# Altium project DAQ.PrjPcb
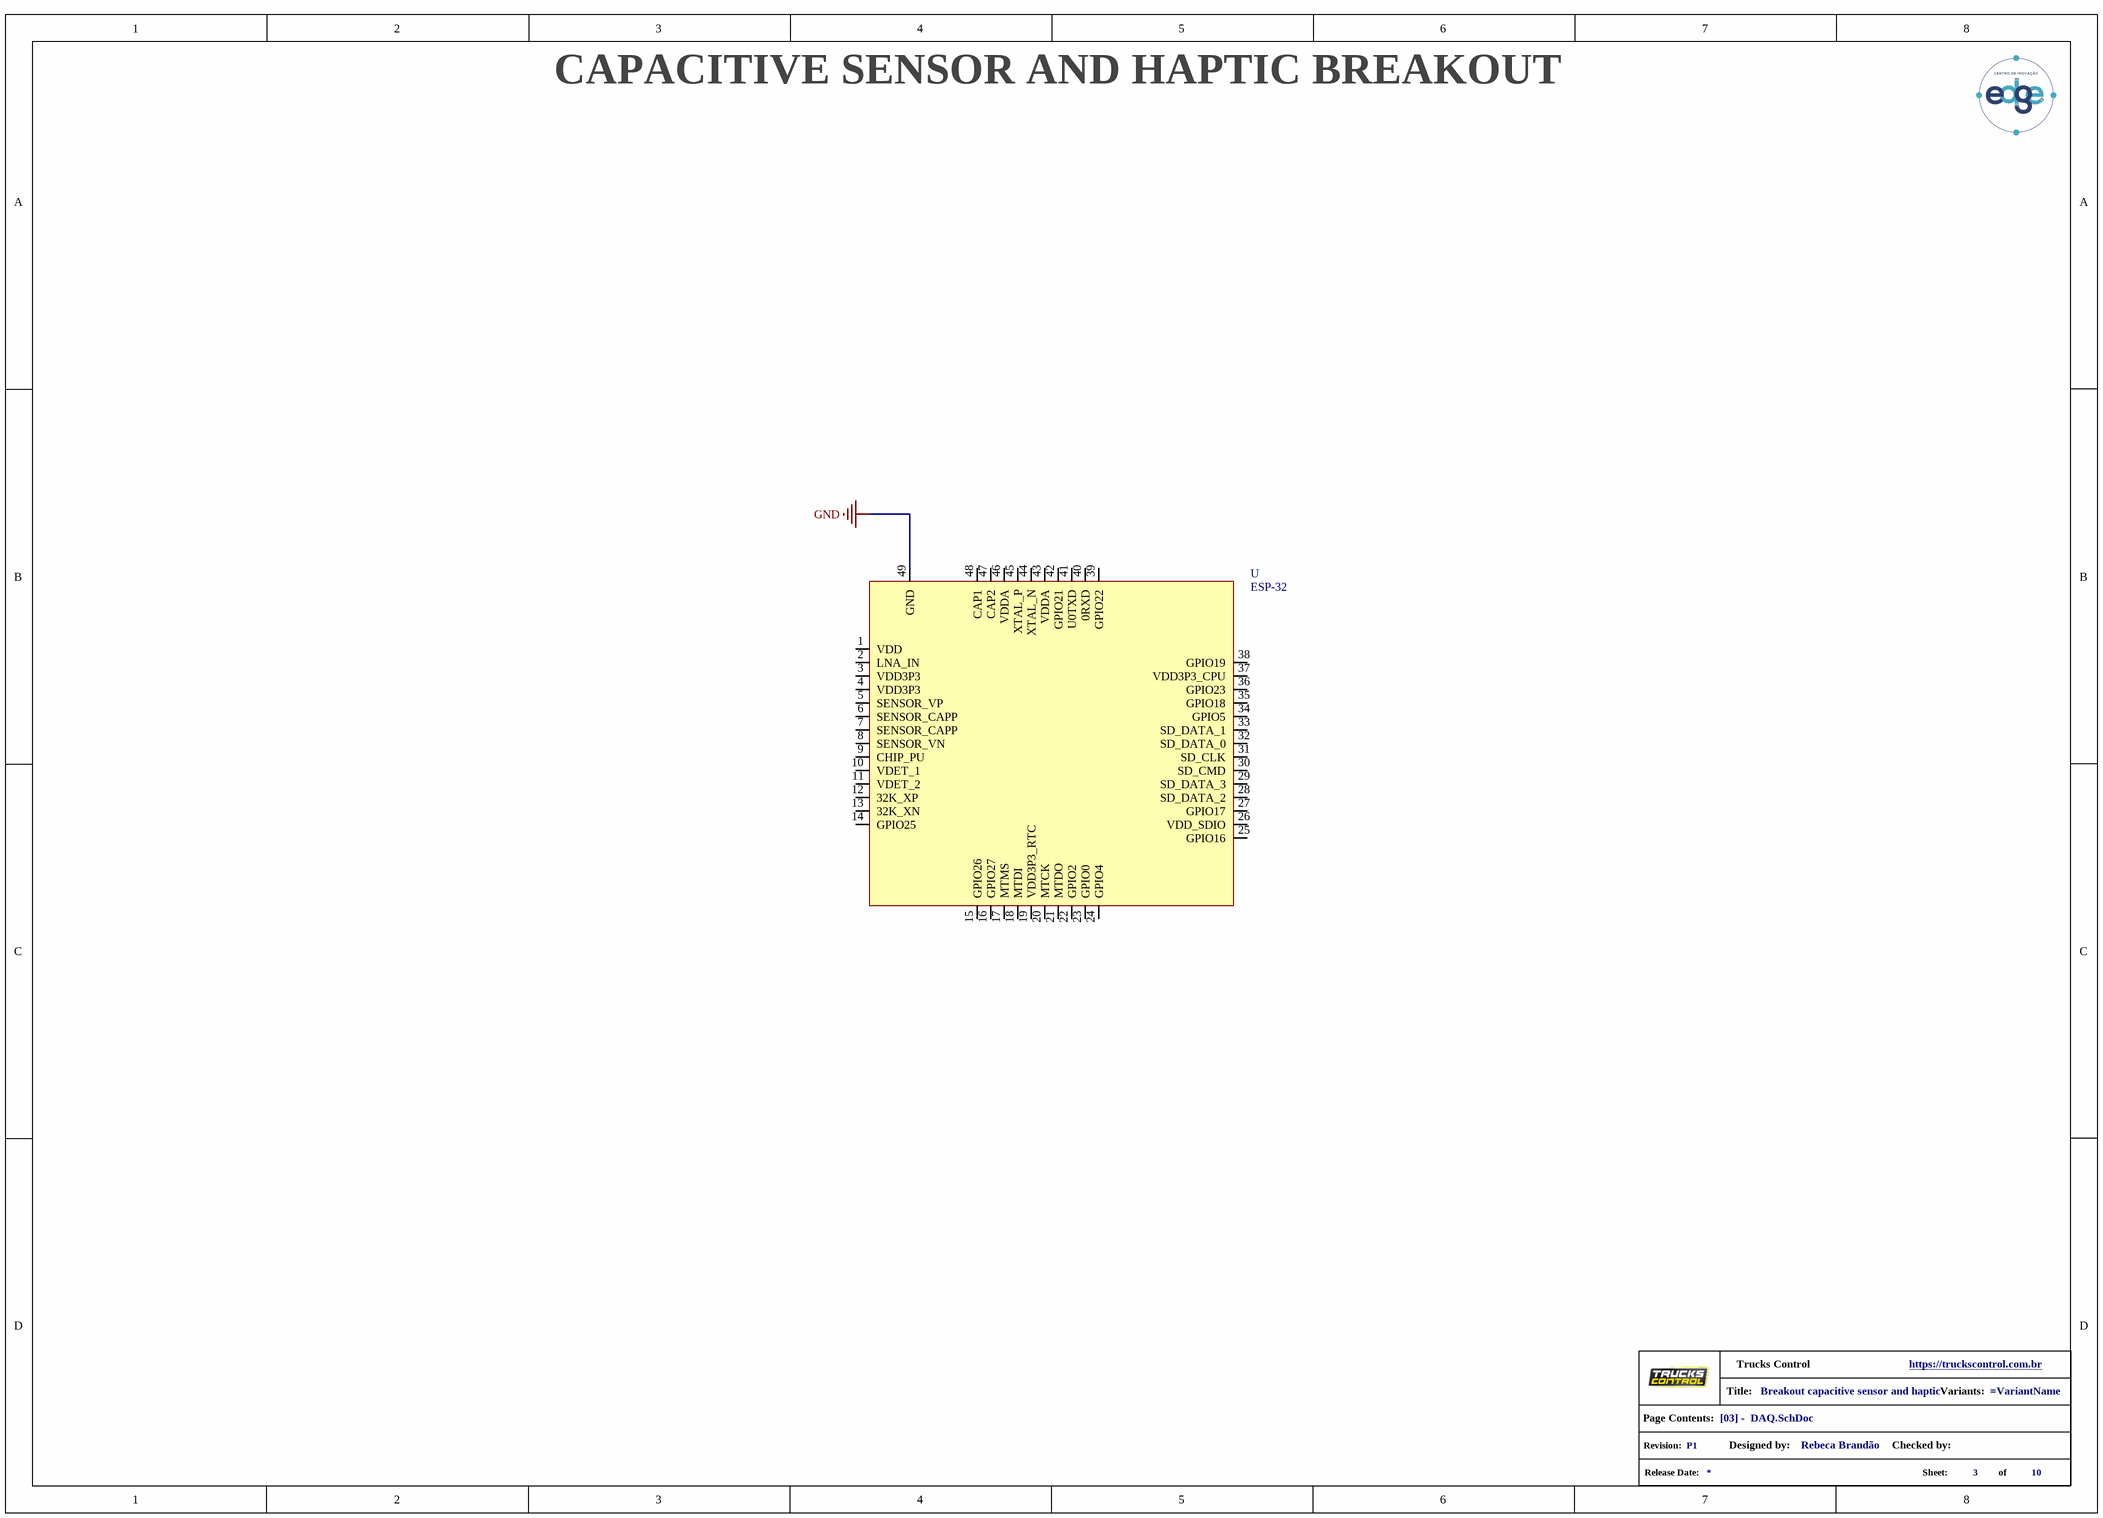
[diagram p0: [03] -  DAQ.SchDoc]
Company: Trucks Control; DesignedProject: Rebeca Brandão; NotFitted: NF; TItleProject: Breakout capacitive sensor and haptic; VersionRevision: P1; Website: https://truckscontrol.com.br
5 sheets, 6 parts. Net scope: global (net labels, ports and power ports of the same name join across sheets).
Board file: DAQ.PcbDoc
Sheets:
  [03] -  DAQ.SchDoc
  DAQ.SchDoc
    Designator = [01] - COVER PAGE.SchDoc
    Designator = [02] - BLOCK DIAGRAM.SchDoc
    Designator = [04] - REVISION HISTORY.SchDoc

## Sheet [03] -  DAQ.SchDoc
size A3; DocumentNumber: 3; SheetNumber: 3; SheetTotal: 10

### Parts
GPH?  info_project  (value not drawn)  (graphical)
U  ESP-32  (no BOM)

### Nets
GND: U.49(GND)

Not connected (* = marked no-connect by the designer): U 1(VDD) 2(LNA_IN) 3(VDD3P3) 4(VDD3P3) 5(SENSOR_VP) 6(SENSOR_CAPP) 7(SENSOR_CAPP) 8(SENSOR_VN) 9(CHIP_PU) 10(VDET_1) 11(VDET_2) 12(32K_XP) 13(32K_XN) 14(GPIO25) 15(GPIO26) 16(GPIO27) 17(MTMS) 18(MTDI) 19(VDD3P3_RTC) 20(MTCK) 21(MTDO) 22(GPIO2) 23(GPIO0) 24(GPIO4) 25(GPIO16) 26(VDD_SDIO) 27(GPIO17) 28(SD_DATA_2) 29(SD_DATA_3) 30(SD_CMD) 31(SD_CLK) 32(SD_DATA_0) 33(SD_DATA_1) 34(GPIO5) 35(____GPIO18) 36(GPIO23) 37(VDD3P3_CPU) 38(GPIO19) 39(GPIO22) 40(0RXD) 41(U0TXD) 42(GPIO21) 43(VDDA) 44(XTAL_N) 45(XTAL_P) 46(VDDA) 47(CAP2) 48(CAP1)

### Notes on the sheet
- CAPACITIVE SENSOR AND HAPTIC BREAKOUT
- (in symbol info_project) Title:; Variants:; Page Contents:; Revision:; Designed by:; Checked by:; Release Date:; Sheet:; of

### Library data of the parts
GPH? = info_project: GRAPHICAL - Info Project
U = ESP32: Supplier 1: Digi-Key; Supplier Part Number 1: 1904-1004-1-ND; .SchChecked: *

## Sheet DAQ.SchDoc
size A4; DocumentNumber: 10; SheetNumber: 10; SheetTotal: 10
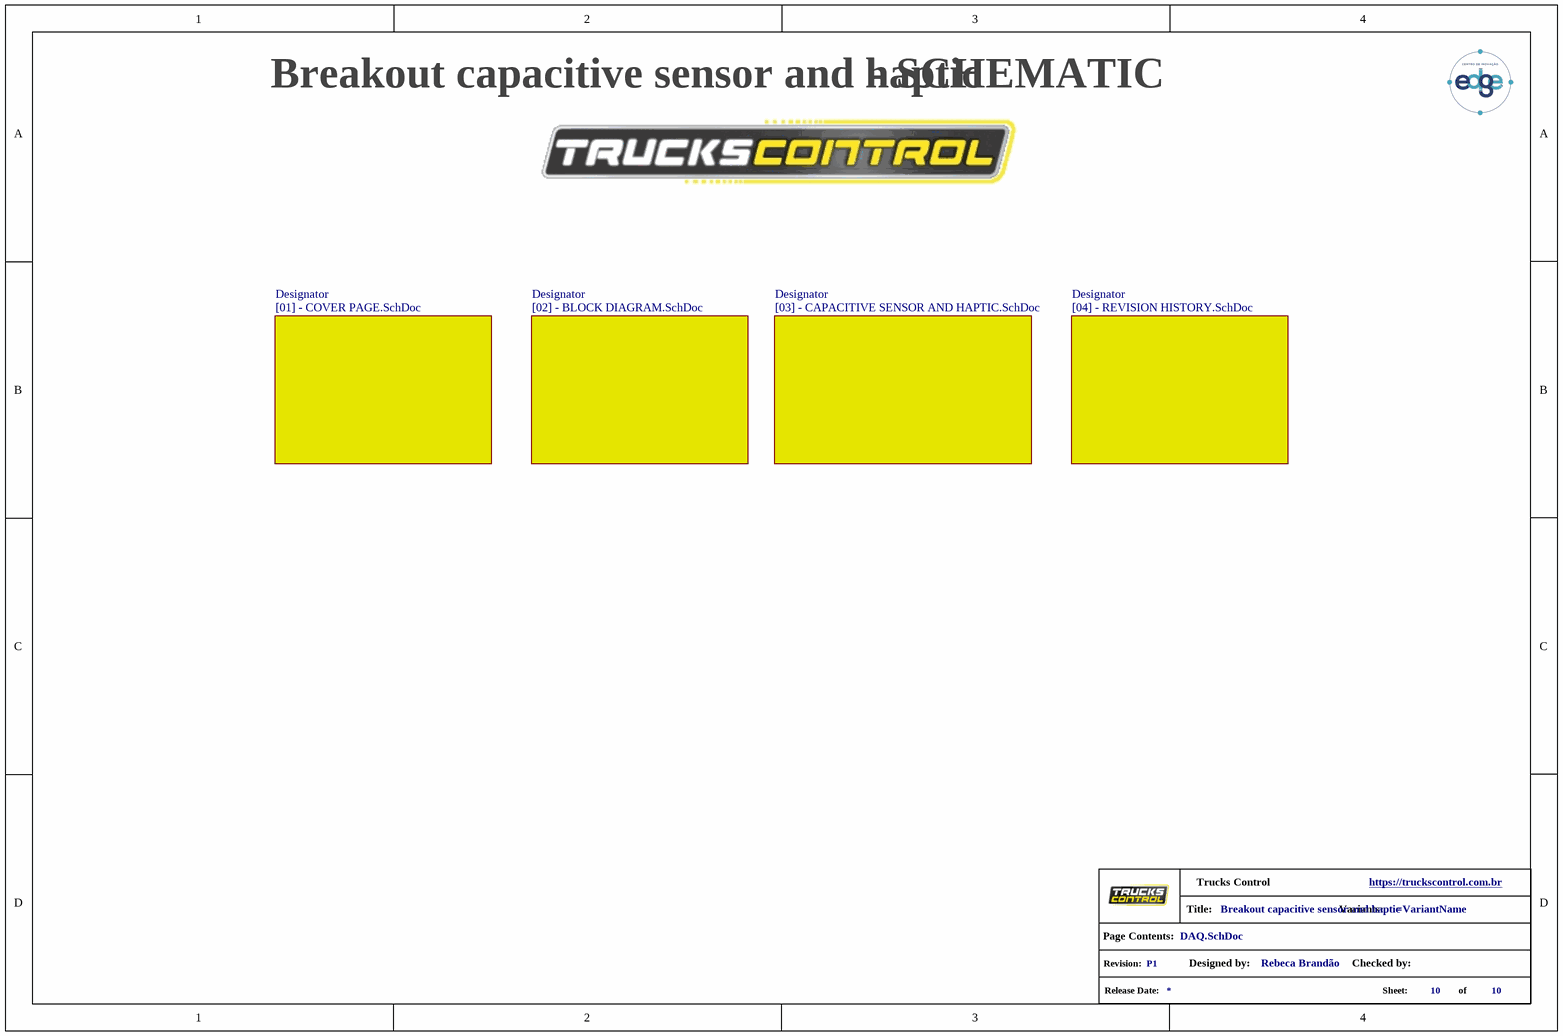
[diagram p1: DAQ.SchDoc]

### Parts
(Parts that share a designator on the sheet are numbered #1, #2 ... from top to bottom, then left to right.)
*?#1  info_project  (value not drawn)  (graphical)

### Sub-sheets
Designator = [01] - COVER PAGE.SchDoc: no entries
Designator = [02] - BLOCK DIAGRAM.SchDoc: no entries
Designator = [03] - CAPACITIVE SENSOR AND HAPTIC.SchDoc (file not in this document): no entries
Designator = [04] - REVISION HISTORY.SchDoc: no entries

### Notes on the sheet
- - SCHEMATIC
- (in symbol info_project) Title:; Variants:; Page Contents:; Revision:; Designed by:; Checked by:; Release Date:; Sheet:; of

### Library data of the parts
*?#1 = info_project: GRAPHICAL - Info Project

## Sheet [01] - COVER PAGE.SchDoc
size A3; DocumentNumber: 1; SheetNumber: 1; SheetTotal: 10
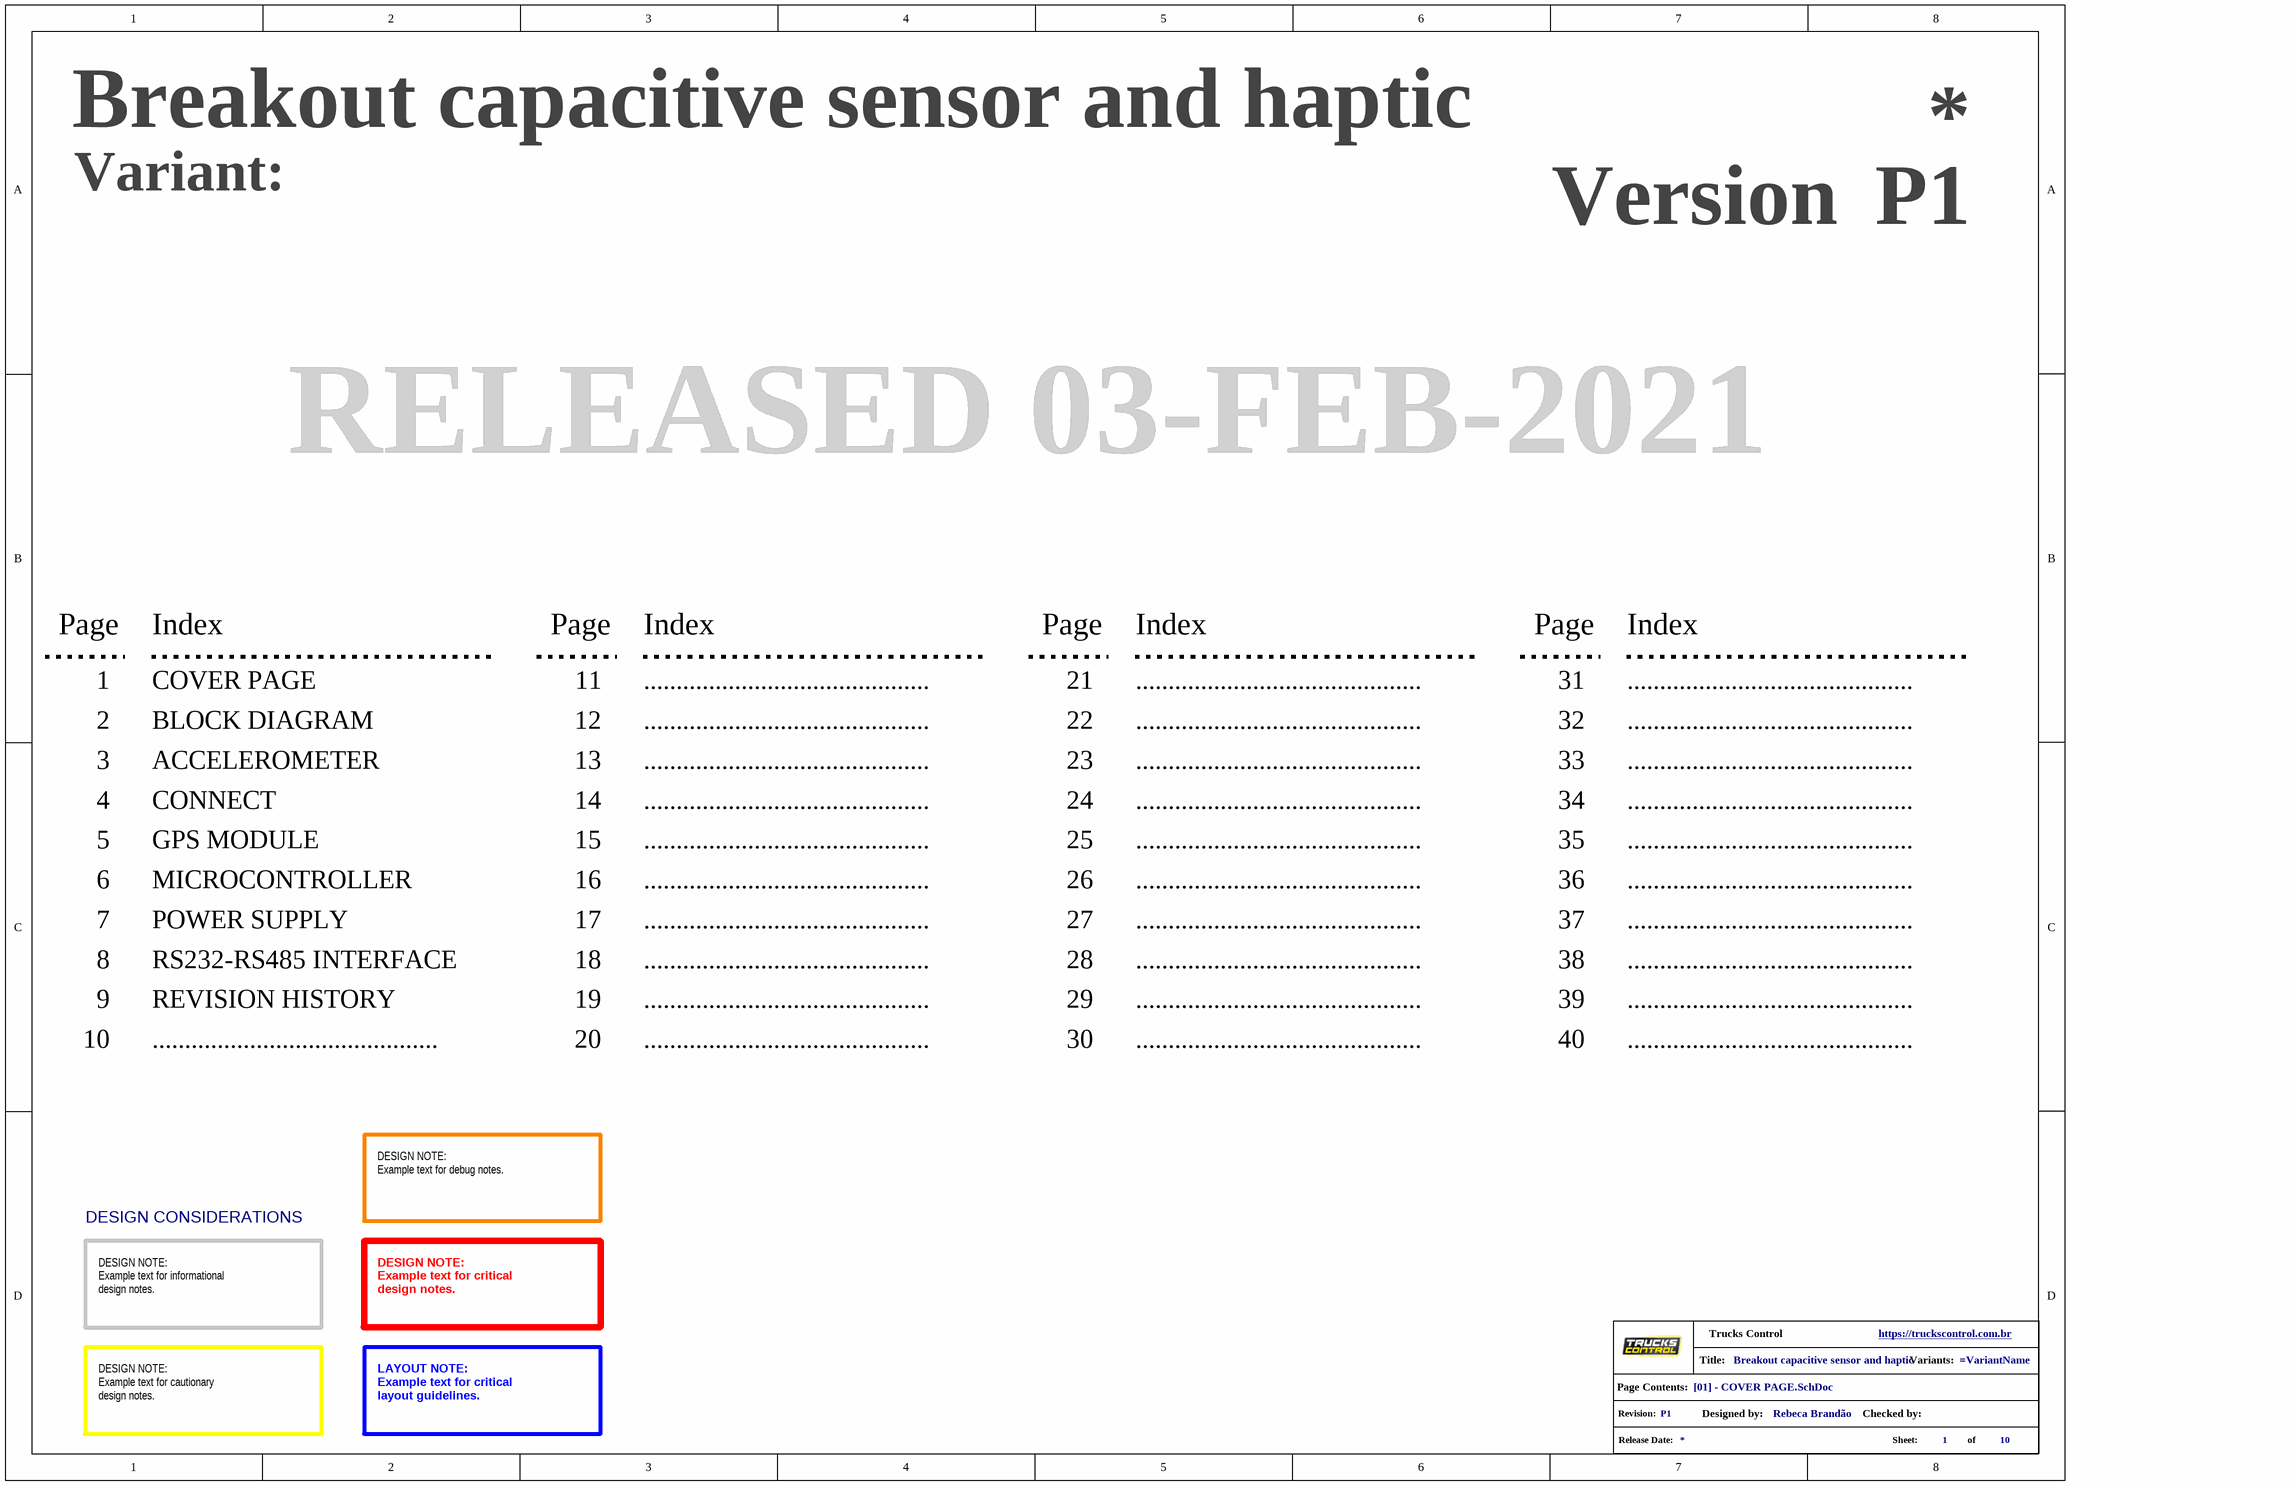
[diagram p2: [01] - COVER PAGE.SchDoc]

### Parts
(Parts that share a designator on the sheet are numbered #1, #2 ... from top to bottom, then left to right.)
*?#2  info_project  (value not drawn)  (graphical)

### Notes on the sheet
- Variant:
- Version
- RELEASED 03-FEB-2021
- Page
- Index
- 1
- COVER PAGE
- 11
- ............................................
- 21
- 31
- 2
- 3
- BLOCK DIAGRAM
- ACCELEROMETER
- 12
- 13
- 22
- 23
- 32
- 33
- 4
- CONNECT
- 14
- 24
- 34
- 5
- 6
- GPS MODULE
- MICROCONTROLLER
- 15
- 16
- 25
- 26
- 35
- 36
- 7
- 8
- POWER SUPPLY
- RS232-RS485 INTERFACE
- 17
- 18
- 27
- 28
- 37
- 38
- 9
- REVISION HISTORY
- 19
- 29
- 39
- 10
- 20
- 30
- 40
- DESIGN CONSIDERATIONS
- DESIGN NOTE:
  Example text for debug notes.
- DESIGN NOTE:
  Example text for informational
  design notes.
- DESIGN NOTE:
  Example text for critical
  design notes.
- DESIGN NOTE:
  Example text for cautionary
  design notes.
- LAYOUT NOTE:
  Example text for critical
  layout guidelines.
- (in symbol info_project) Title:; Variants:; Page Contents:; Revision:; Designed by:; Checked by:; Release Date:; Sheet:; of

### Library data of the parts
*?#2 = info_project: GRAPHICAL - Info Project

## Sheet [02] - BLOCK DIAGRAM.SchDoc
size A2; DocumentNumber: 2; SheetNumber: 2; SheetTotal: 10; PageSetup: Record=PageOptions|CenterHorizontal=True|CenterVertical=True|PrintScale=0.52|XCorrection=1.00|YCorrection=1.00|PrintKind=1|BorderSize=5000000|LeftOffset=0|BottomOffset=0|Orientation=2|PaperLength=1000|PaperWidth=1000|Scale=100|PaperSource=4|PrintQuality=600|MediaType=1|DitherType=10|PrintScaleMode=1|PaperKind=A4|PaperIndex=9
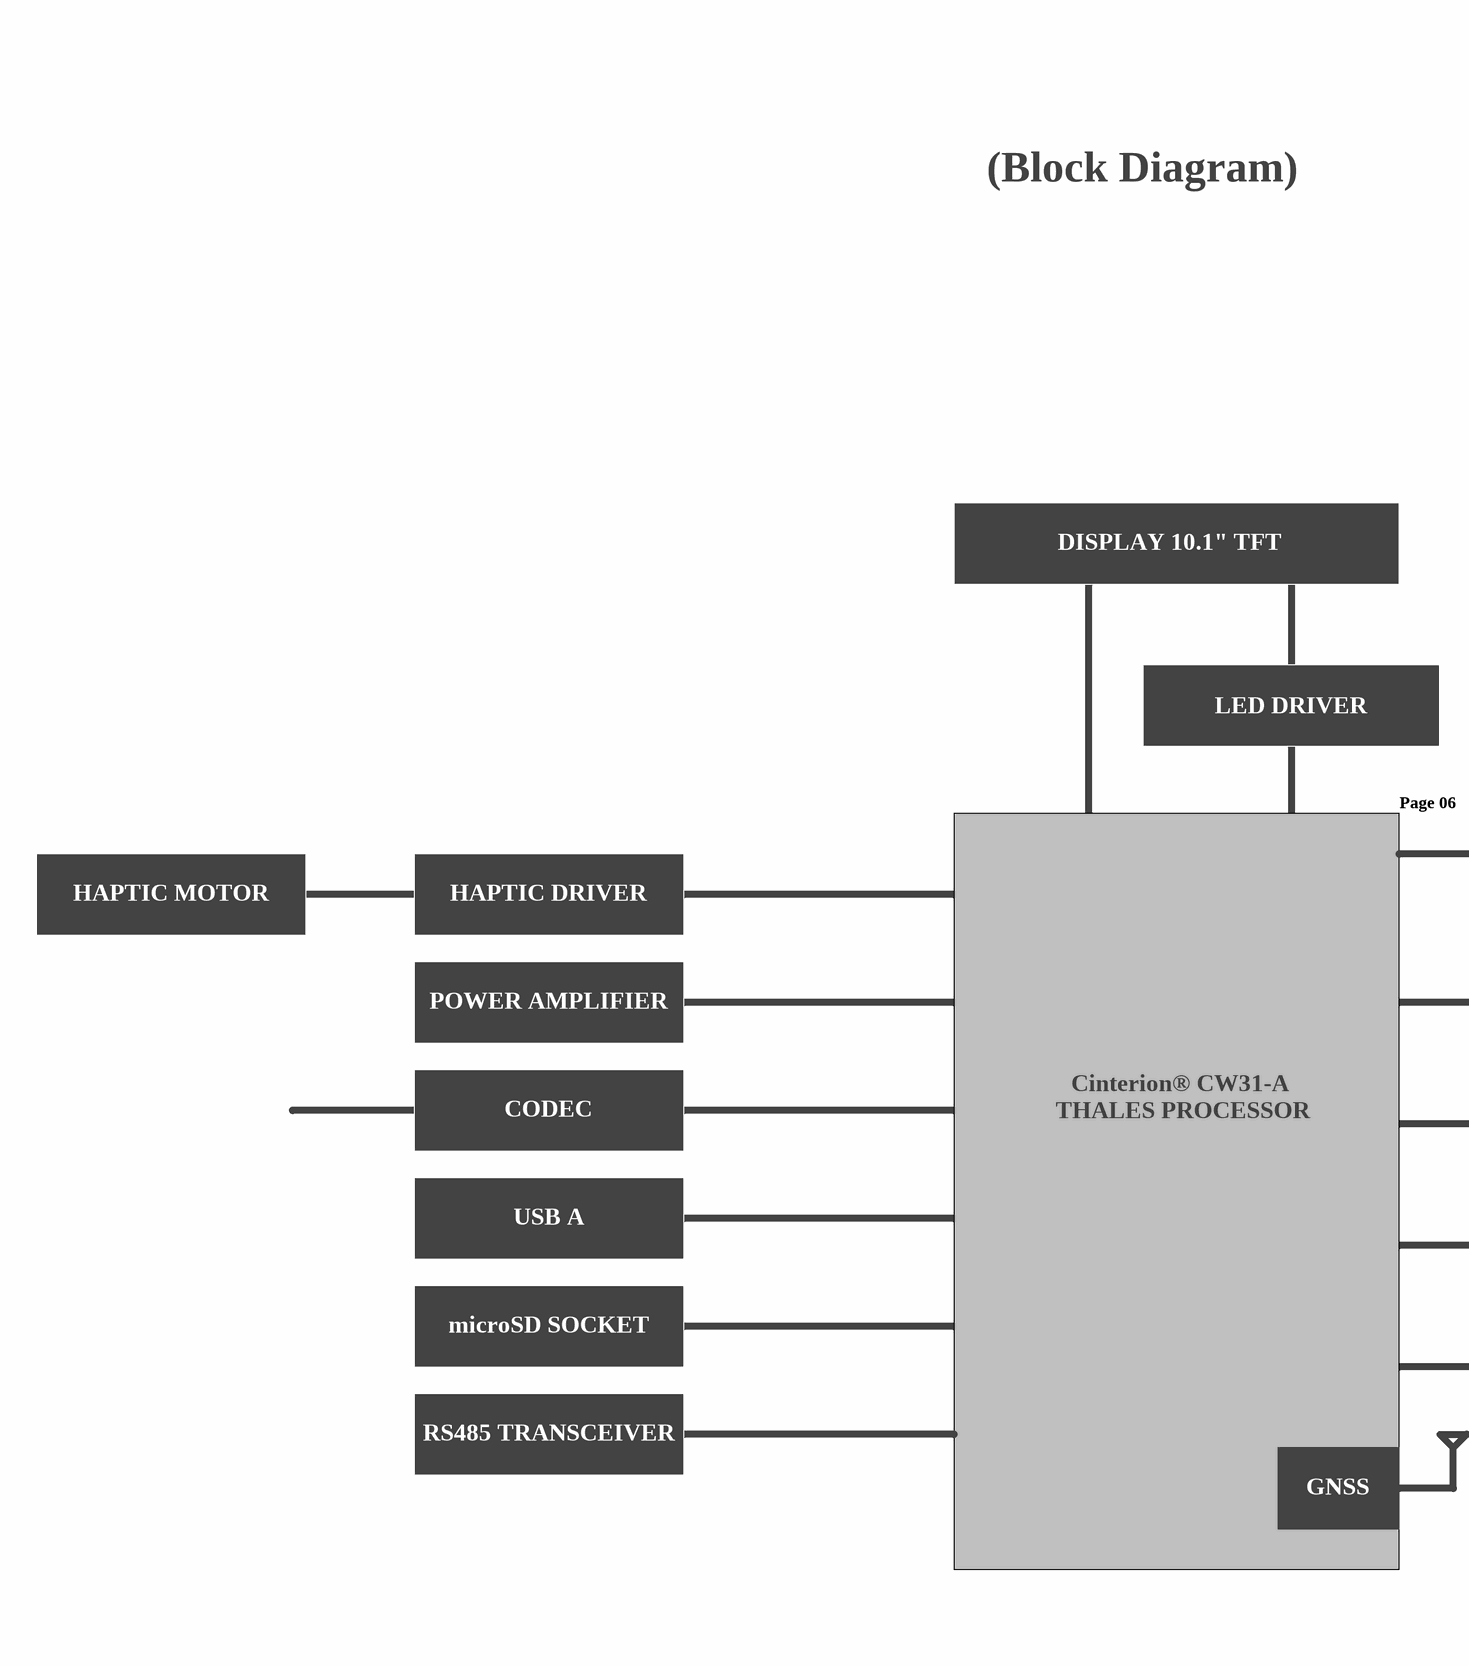
[diagram p3: [02] - BLOCK DIAGRAM.SchDoc, left]
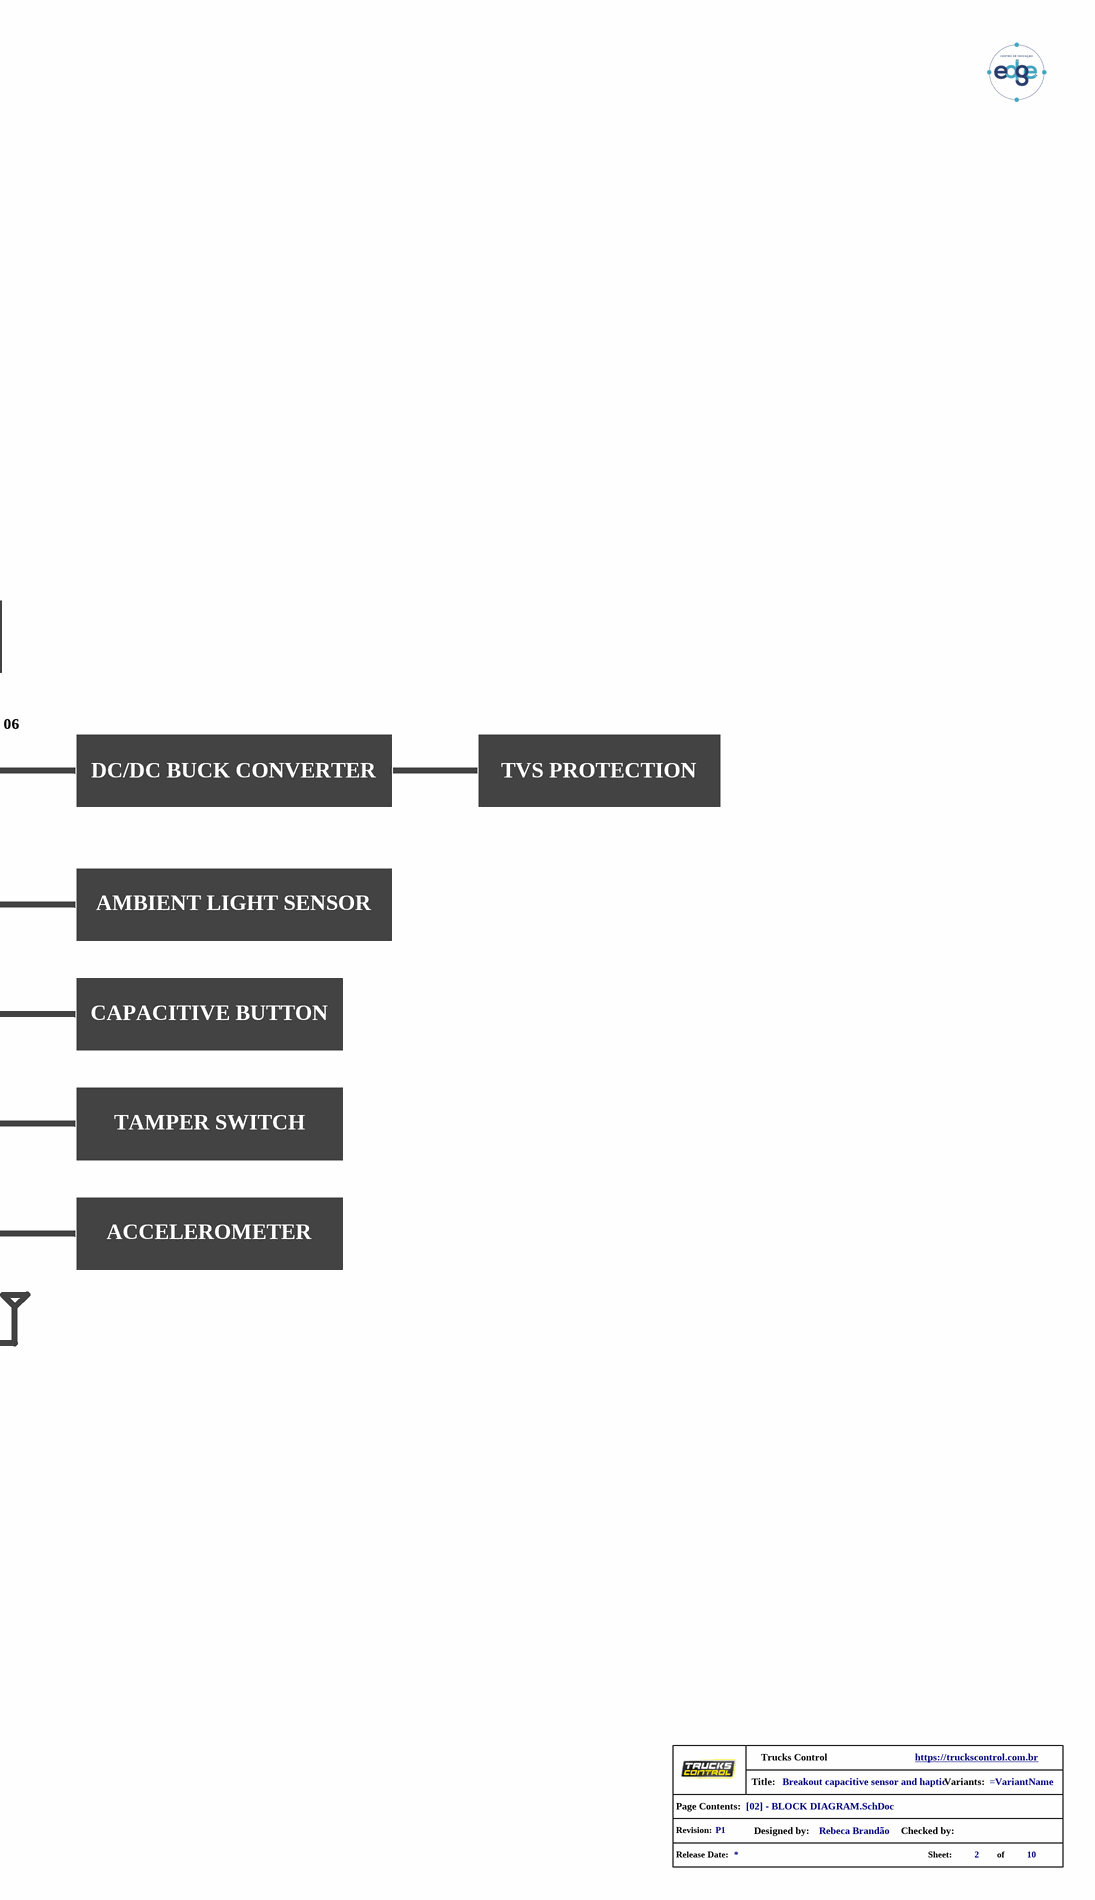
[diagram p4: [02] - BLOCK DIAGRAM.SchDoc, right]

### Parts
(Parts that share a designator on the sheet are numbered #1, #2 ... from top to bottom, then left to right.)
*?#3  info_project  (value not drawn)  (graphical)

### Notes on the sheet
- (Block Diagram)
- DISPLAY 10.1" TFT
- LED DRIVER
- Page 06
- DC/DC BUCK CONVERTER
- TVS PROTECTION
- HAPTIC MOTOR
- HAPTIC DRIVER
- POWER AMPLIFIER
- AMBIENT LIGHT SENSOR
- CODEC
- Cinterion® CW31-A
- THALES PROCESSOR
- CAPACITIVE BUTTON
- USB A
- TAMPER SWITCH
- microSD SOCKET
- ACCELEROMETER
- RS485 TRANSCEIVER
- GNSS
- (in symbol info_project) Title:; Variants:; Page Contents:; Revision:; Designed by:; Checked by:; Release Date:; Sheet:; of

### Library data of the parts
*?#3 = info_project: GRAPHICAL - Info Project

## Sheet [04] - REVISION HISTORY.SchDoc
size A3; DocumentNumber: 9; SheetNumber: 9; SheetTotal: 10
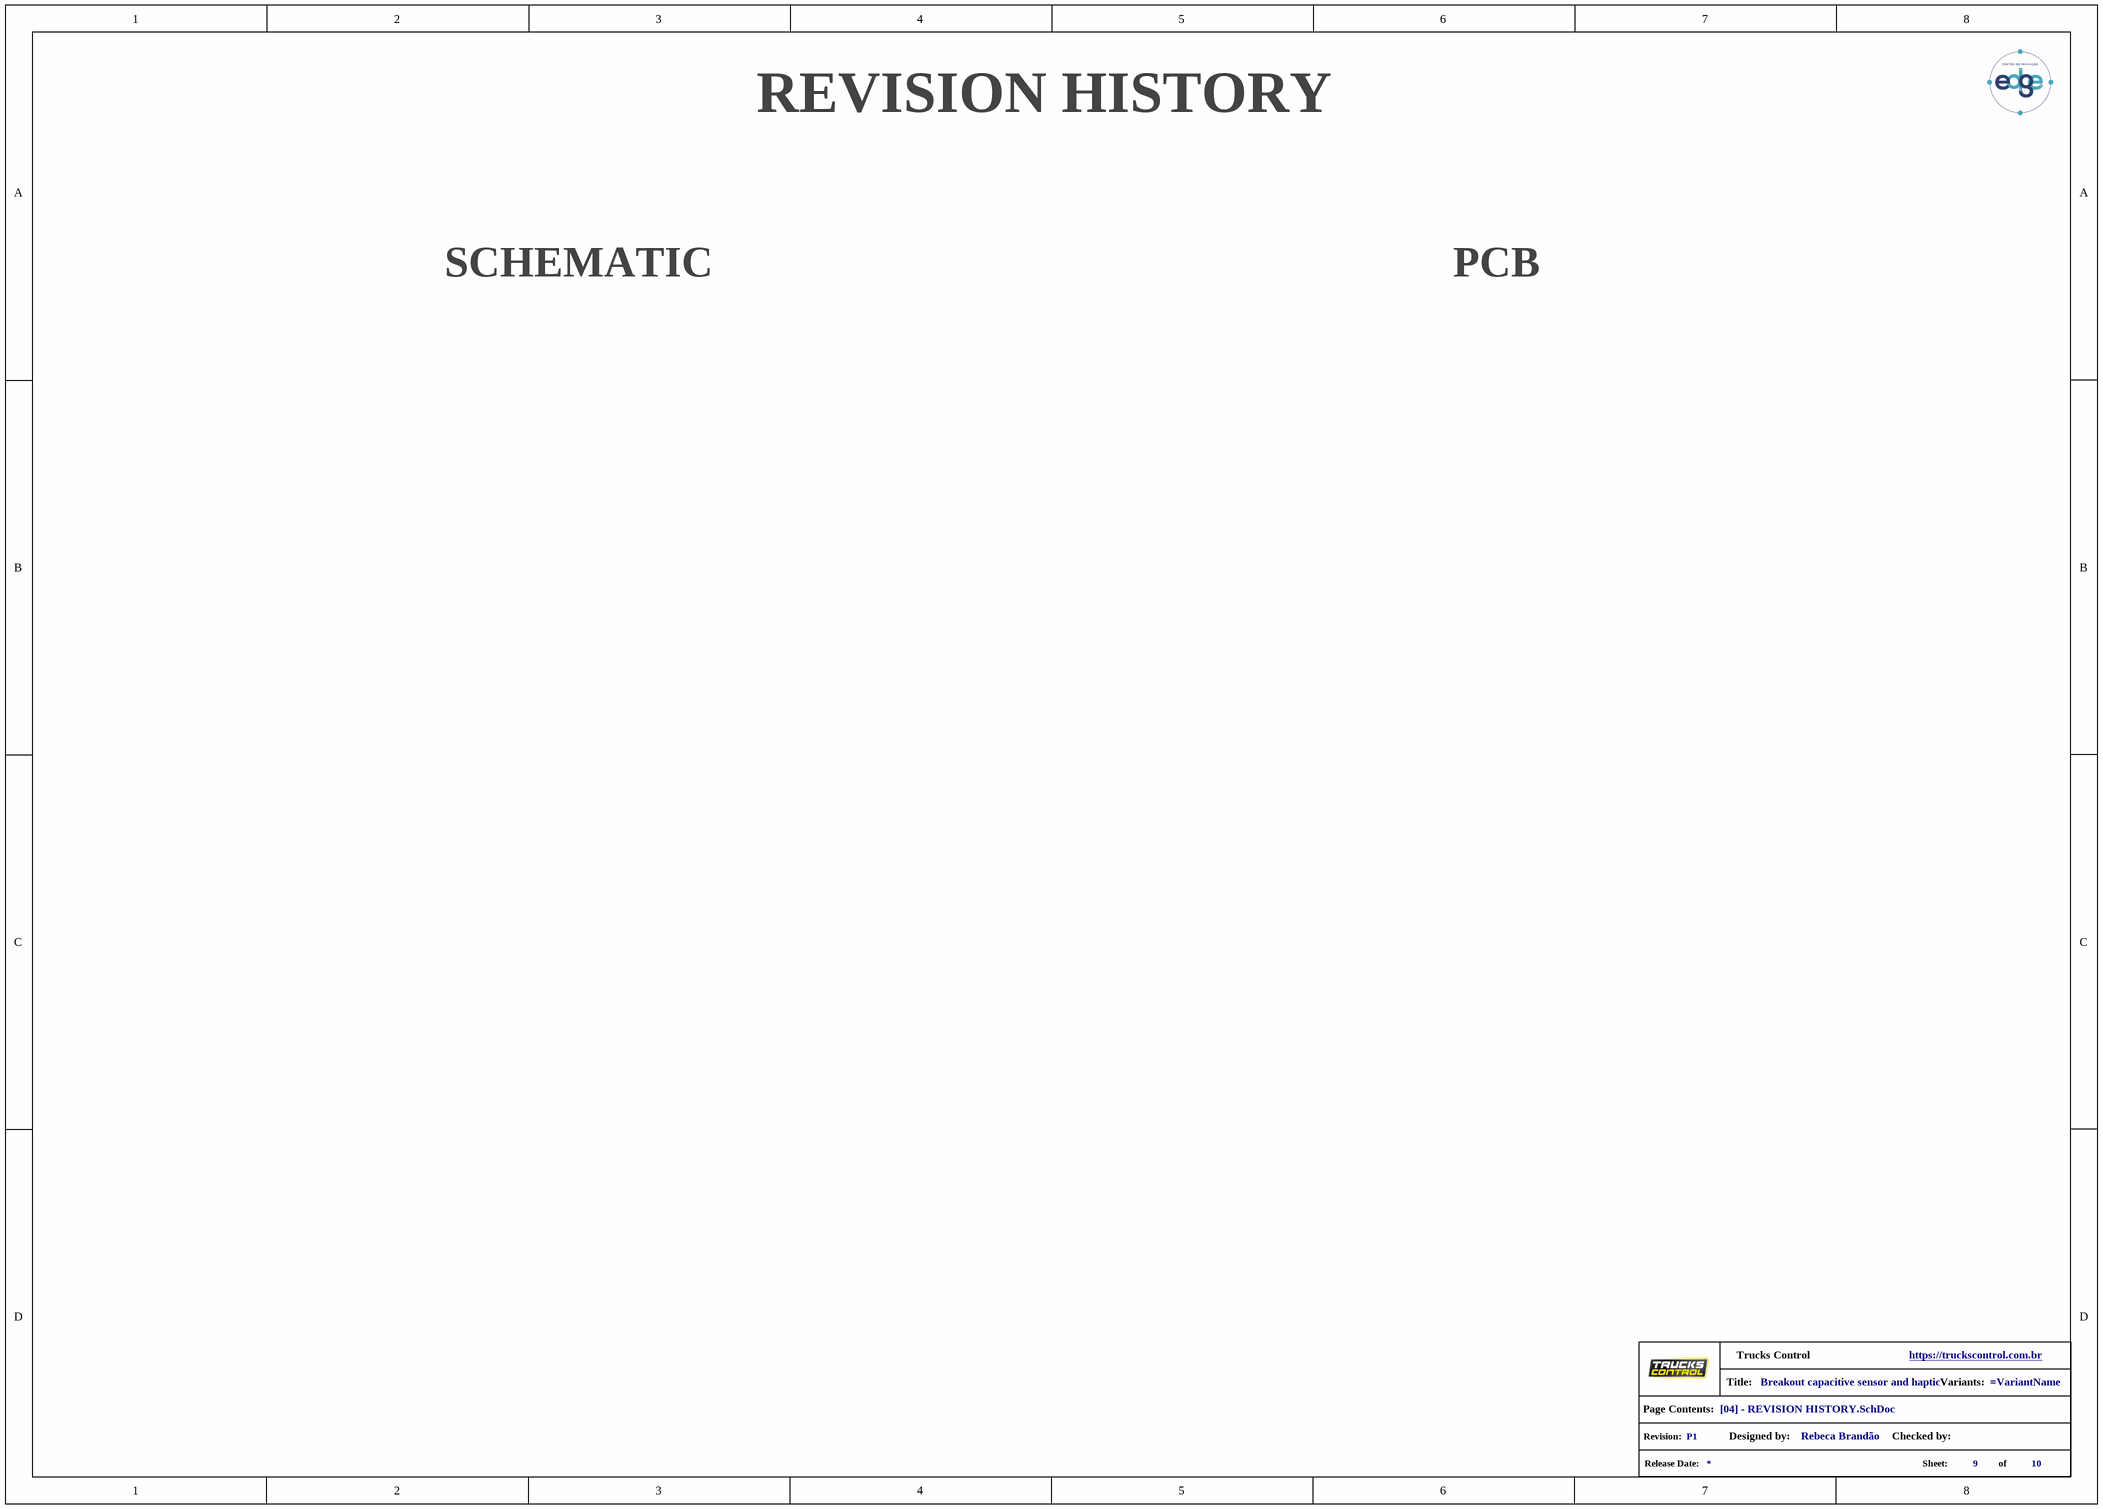
[diagram p5: [04] - REVISION HISTORY.SchDoc]

### Parts
*  info_project  (value not drawn)  (graphical)

### Notes on the sheet
- REVISION HISTORY
- SCHEMATIC
- PCB
- (in symbol info_project) Title:; Variants:; Page Contents:; Revision:; Designed by:; Checked by:; Release Date:; Sheet:; of

### Library data of the parts
* = info_project: GRAPHICAL - Info Project